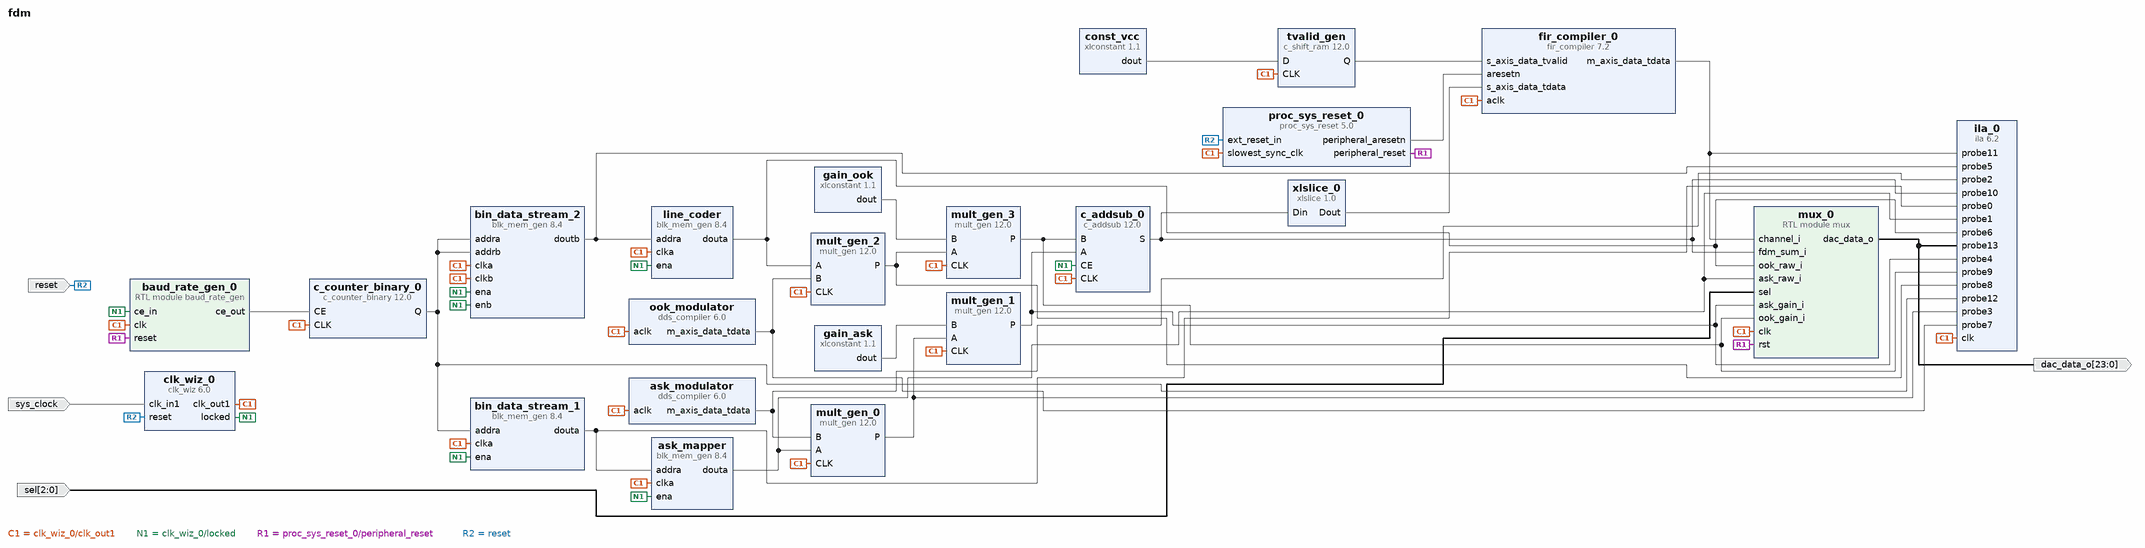
[diagram p0: block diagram of the top level]
# Vivado block design fdm, xc7z020clg400-1, Vivado 2025.2
create_bd_design fdm

create_bd_port -dir I -type clk sys_clock
set_property -dict {CONFIG.FREQ_HZ 125000000 CONFIG.PHASE 0.0} [get_bd_ports sys_clock]
create_bd_port -dir I -type rst reset
set_property -dict {CONFIG.POLARITY ACTIVE_HIGH} [get_bd_ports reset]
create_bd_port -dir I -from 2 -to 0 sel
create_bd_port -dir O -from 23 -to 0 dac_data_o

create_bd_cell -type ip -vlnv xilinx.com:ip:blk_mem_gen:8.4 bin_data_stream_1
set_property -dict [list \
  CONFIG.Coe_File ../../../../../../test.coe \
  CONFIG.Fill_Remaining_Memory_Locations true \
  CONFIG.Load_Init_File true \
  CONFIG.Memory_Type Single_Port_ROM \
  CONFIG.Write_Depth_A 16 \
  CONFIG.Write_Width_A 2 \
  CONFIG.use_bram_block Stand_Alone \
] [get_bd_cells bin_data_stream_1]
create_bd_cell -type ip -vlnv xilinx.com:ip:blk_mem_gen:8.4 ask_mapper
set_property -dict [list \
  CONFIG.Coe_File ../../../../../../mapper_4ask.coe \
  CONFIG.Enable_A Use_ENA_Pin \
  CONFIG.Fill_Remaining_Memory_Locations false \
  CONFIG.Load_Init_File true \
  CONFIG.Memory_Type Single_Port_ROM \
  CONFIG.Write_Depth_A 4 \
  CONFIG.Write_Width_A 16 \
  CONFIG.use_bram_block Stand_Alone \
] [get_bd_cells ask_mapper]
create_bd_cell -type ip -vlnv xilinx.com:ip:ila:6.2 ila_0
set_property -dict [list \
  CONFIG.ALL_PROBE_SAME_MU_CNT 4 \
  CONFIG.C_MONITOR_TYPE Native \
  CONFIG.C_NUM_OF_PROBES 14 \
  CONFIG.C_PROBE0_WIDTH 2 \
  CONFIG.C_PROBE10_WIDTH 40 \
  CONFIG.C_PROBE11_WIDTH 48 \
  CONFIG.C_PROBE12_WIDTH 4 \
  CONFIG.C_PROBE13_WIDTH 24 \
  CONFIG.C_PROBE1_WIDTH 16 \
  CONFIG.C_PROBE2_WIDTH 16 \
  CONFIG.C_PROBE3_WIDTH 32 \
  CONFIG.C_PROBE4_WIDTH 40 \
  CONFIG.C_PROBE5_WIDTH 1 \
  CONFIG.C_PROBE6_WIDTH 16 \
  CONFIG.C_PROBE7_WIDTH 16 \
  CONFIG.C_PROBE8_WIDTH 32 \
  CONFIG.C_PROBE9_WIDTH 40 \
] [get_bd_cells ila_0]
create_bd_cell -type ip -vlnv xilinx.com:ip:clk_wiz:6.0 clk_wiz_0
set_property -dict {CONFIG.CLK_IN1_BOARD_INTERFACE sys_clock CONFIG.USE_BOARD_FLOW true} [get_bd_cells clk_wiz_0]
create_bd_cell -type ip -vlnv xilinx.com:ip:dds_compiler:6.0 ask_modulator
set_property -dict {CONFIG.Output_Frequency1 1 CONFIG.PINC1 1010001111010111000010} [get_bd_cells ask_modulator]
create_bd_cell -type ip -vlnv xilinx.com:ip:mult_gen:12.0 mult_gen_0
set_property -dict {CONFIG.PortAWidth 16 CONFIG.PortBWidth 16} [get_bd_cells mult_gen_0]
create_bd_cell -type ip -vlnv xilinx.com:ip:mult_gen:12.0 mult_gen_1
set_property -dict {CONFIG.PortAWidth 32 CONFIG.PortBWidth 8} [get_bd_cells mult_gen_1]
create_bd_cell -type ip -vlnv xilinx.com:ip:xlconstant:1.1 gain_ask
set_property -dict {CONFIG.CONST_VAL 1 CONFIG.CONST_WIDTH 8} [get_bd_cells gain_ask]
create_bd_cell -type ip -vlnv xilinx.com:ip:blk_mem_gen:8.4 bin_data_stream_2
set_property -dict [list \
  CONFIG.Coe_File ../../../../../../data.coe \
  CONFIG.Fill_Remaining_Memory_Locations true \
  CONFIG.Load_Init_File true \
  CONFIG.Memory_Type Simple_Dual_Port_RAM \
  CONFIG.Read_Width_B 1 \
  CONFIG.Write_Depth_A 16 \
  CONFIG.Write_Width_A 1 \
  CONFIG.Write_Width_B 1 \
  CONFIG.use_bram_block Stand_Alone \
] [get_bd_cells bin_data_stream_2]
create_bd_cell -type ip -vlnv xilinx.com:ip:blk_mem_gen:8.4 line_coder
set_property -dict [list \
  CONFIG.Coe_File ../../../../../../mapper_2ask.coe \
  CONFIG.Enable_A Use_ENA_Pin \
  CONFIG.Fill_Remaining_Memory_Locations true \
  CONFIG.Load_Init_File true \
  CONFIG.Read_Width_A 16 \
  CONFIG.Use_Byte_Write_Enable false \
  CONFIG.Write_Depth_A 2 \
  CONFIG.Write_Width_A 16 \
  CONFIG.use_bram_block Stand_Alone \
] [get_bd_cells line_coder]
create_bd_cell -type ip -vlnv xilinx.com:ip:mult_gen:12.0 mult_gen_2
set_property -dict {CONFIG.PortAWidth 16 CONFIG.PortBWidth 16} [get_bd_cells mult_gen_2]
create_bd_cell -type ip -vlnv xilinx.com:ip:xlconstant:1.1 gain_ook
set_property -dict {CONFIG.CONST_VAL 1 CONFIG.CONST_WIDTH 8} [get_bd_cells gain_ook]
create_bd_cell -type ip -vlnv xilinx.com:ip:mult_gen:12.0 mult_gen_3
set_property -dict {CONFIG.PortAWidth 32 CONFIG.PortBWidth 8} [get_bd_cells mult_gen_3]
create_bd_cell -type ip -vlnv xilinx.com:ip:c_addsub:12.0 c_addsub_0
set_property -dict [list \
  CONFIG.A_Width 40 \
  CONFIG.B_Value 0000000000000000000000000000000000000000 \
  CONFIG.B_Width 40 \
  CONFIG.Latency 1 \
  CONFIG.Out_Width 40 \
] [get_bd_cells c_addsub_0]
create_bd_cell -type ip -vlnv xilinx.com:ip:fir_compiler:7.2 fir_compiler_0
set_property -dict [list \
  CONFIG.Clock_Frequency 125.0 \
  CONFIG.CoefficientVector {['-32767, -1750, -1769, -1778, -1763, -1733, -1679, -1615, -1519, -1412, -1275, -1125, -943, -748, -522, -281, -11, 272, 584, 909, 1260, 1620, 2008, 2401, 2822, 3242, 3702, 4150, 4636, 5117, 5645, 6114,', '6579, 7132, 7622, 8141, 8642, 9157, 9654, 10152, 10638, 11116, 11580, 12032, 12467, 12886, 13285, 13666, 14023, 14358, 14668, 14956, 15212, 15445, 15647, 15823, 15960, 16068, 16161, 16191, 16209,', '16191, 16161, 16068, 15960, 15823, 15647, 15445, 15212, 14956, 14668, 14358, 14023, 13666, 13285, 12886, 12467, 12032, 11580, 11116, 10638, 10152, 9654, 9157, 8642, 8141, 7622, 7132, 6579, 6114, 5645,', '5117, 4636, 4150, 3702, 3242, 2822, 2401, 2008, 1620, 1260, 909, 584, 272, -11, -281, -522, -748, -943, -1125, -1275, -1412, -1519, -1615, -1679, -1733, -1763, -1778, -1769, -1750, -32767']} \
  CONFIG.Coefficient_Fractional_Bits 0 \
  CONFIG.Coefficient_Sets 1 \
  CONFIG.Coefficient_Sign Signed \
  CONFIG.Coefficient_Structure Inferred \
  CONFIG.Coefficient_Width 16 \
  CONFIG.ColumnConfig 20,20,21 \
  CONFIG.Data_Width 24 \
  CONFIG.Has_ARESETn true \
  CONFIG.Output_Rounding_Mode Full_Precision \
  CONFIG.Output_Width 44 \
  CONFIG.Quantization Integer_Coefficients \
  CONFIG.Sample_Frequency 125.0 \
] [get_bd_cells fir_compiler_0]
create_bd_cell -type ip -vlnv xilinx.com:ip:c_shift_ram:12.0 tvalid_gen
set_property -dict {CONFIG.Depth 1 CONFIG.Width 1} [get_bd_cells tvalid_gen]
create_bd_cell -type ip -vlnv xilinx.com:ip:c_counter_binary:12.0 c_counter_binary_0
set_property -dict {CONFIG.CE true CONFIG.Output_Width 4} [get_bd_cells c_counter_binary_0]
create_bd_cell -type ip -vlnv xilinx.com:ip:proc_sys_reset:5.0 proc_sys_reset_0
create_bd_cell -type module -reference mux mux_0
create_bd_cell -type ip -vlnv xilinx.com:ip:xlconstant:1.1 const_vcc
set_property -dict {CONFIG.CONST_VAL 1} [get_bd_cells const_vcc]
create_bd_cell -type module -reference baud_rate_gen baud_rate_gen_0
create_bd_cell -type ip -vlnv xilinx.com:ip:dds_compiler:6.0 ook_modulator
set_property -dict {CONFIG.Output_Frequency1 2 CONFIG.PINC1 10100011110101110000101} [get_bd_cells ook_modulator]
create_bd_cell -type ip -vlnv xilinx.com:ip:xlslice:1.0 xlslice_0
set_property -dict {CONFIG.DIN_FROM 39 CONFIG.DIN_TO 16 CONFIG.DIN_WIDTH 40} [get_bd_cells xlslice_0]

# ---- connections ----

connect_bd_net [get_bd_pins ask_mapper/douta] [get_bd_pins ila_0/probe1] [get_bd_pins mux_0/ask_raw_i] [get_bd_pins mult_gen_0/A]
connect_bd_net [get_bd_pins ask_modulator/m_axis_data_tdata] [get_bd_pins mult_gen_0/B] [get_bd_pins ila_0/probe2]
connect_bd_net [get_bd_pins baud_rate_gen_0/ce_out] [get_bd_pins c_counter_binary_0/CE]
connect_bd_net [get_bd_pins bin_data_stream_1/douta] [get_bd_pins ask_mapper/addra] [get_bd_pins ila_0/probe0]
connect_bd_net [get_bd_pins bin_data_stream_2/doutb] [get_bd_pins line_coder/addra] [get_bd_pins ila_0/probe5]
connect_bd_net [get_bd_pins c_addsub_0/S] [get_bd_pins xlslice_0/Din] [get_bd_pins mux_0/fdm_sum_i] [get_bd_pins ila_0/probe10]
connect_bd_net [get_bd_pins c_counter_binary_0/Q] \
  [get_bd_pins bin_data_stream_1/addra] [get_bd_pins ila_0/probe12] [get_bd_pins bin_data_stream_2/addra] \
  [get_bd_pins bin_data_stream_2/addrb]
connect_bd_net [get_bd_pins clk_wiz_0/clk_out1] \
  [get_bd_pins bin_data_stream_1/clka] [get_bd_pins ask_mapper/clka] [get_bd_pins ila_0/clk] [get_bd_pins ask_modulator/aclk] \
  [get_bd_pins mult_gen_1/CLK] [get_bd_pins mult_gen_0/CLK] [get_bd_pins bin_data_stream_2/clka] \
  [get_bd_pins line_coder/clka] [get_bd_pins mult_gen_2/CLK] [get_bd_pins mult_gen_3/CLK] [get_bd_pins c_addsub_0/CLK] \
  [get_bd_pins fir_compiler_0/aclk] [get_bd_pins tvalid_gen/CLK] [get_bd_pins c_counter_binary_0/CLK] \
  [get_bd_pins bin_data_stream_2/clkb] [get_bd_pins proc_sys_reset_0/slowest_sync_clk] [get_bd_pins mux_0/clk] \
  [get_bd_pins baud_rate_gen_0/clk] [get_bd_pins ook_modulator/aclk]
connect_bd_net [get_bd_pins clk_wiz_0/locked] \
  [get_bd_pins bin_data_stream_1/ena] [get_bd_pins ask_mapper/ena] [get_bd_pins bin_data_stream_2/ena] \
  [get_bd_pins line_coder/ena] [get_bd_pins c_addsub_0/CE] [get_bd_pins bin_data_stream_2/enb] \
  [get_bd_pins baud_rate_gen_0/ce_in]
connect_bd_net [get_bd_pins const_vcc/dout] [get_bd_pins tvalid_gen/D]
connect_bd_net [get_bd_pins fir_compiler_0/m_axis_data_tdata] [get_bd_pins ila_0/probe11] [get_bd_pins mux_0/channel_i]
connect_bd_net [get_bd_pins gain_ask/dout] [get_bd_pins mult_gen_1/B]
connect_bd_net [get_bd_pins gain_ook/dout] [get_bd_pins mult_gen_3/B]
connect_bd_net [get_bd_pins line_coder/douta] [get_bd_pins ila_0/probe6] [get_bd_pins mux_0/ook_raw_i] [get_bd_pins mult_gen_2/A]
connect_bd_net [get_bd_pins mult_gen_0/P] [get_bd_pins mult_gen_1/A] [get_bd_pins ila_0/probe3]
connect_bd_net [get_bd_pins mult_gen_1/P] [get_bd_pins ila_0/probe4] [get_bd_pins c_addsub_0/A] [get_bd_pins mux_0/ask_gain_i]
connect_bd_net [get_bd_pins mult_gen_2/P] [get_bd_pins mult_gen_3/A] [get_bd_pins ila_0/probe8]
connect_bd_net [get_bd_pins mult_gen_3/P] [get_bd_pins ila_0/probe9] [get_bd_pins c_addsub_0/B] [get_bd_pins mux_0/ook_gain_i]
connect_bd_net [get_bd_pins mux_0/dac_data_o] [get_bd_pins ila_0/probe13] [get_bd_ports dac_data_o]
connect_bd_net [get_bd_pins ook_modulator/m_axis_data_tdata] [get_bd_pins mult_gen_2/B] [get_bd_pins ila_0/probe7]
connect_bd_net [get_bd_pins proc_sys_reset_0/peripheral_aresetn] [get_bd_pins fir_compiler_0/aresetn]
connect_bd_net [get_bd_pins proc_sys_reset_0/peripheral_reset] [get_bd_pins mux_0/rst] [get_bd_pins baud_rate_gen_0/reset]
connect_bd_net [get_bd_ports reset] [get_bd_pins clk_wiz_0/reset] [get_bd_pins proc_sys_reset_0/ext_reset_in]
connect_bd_net [get_bd_ports sel] [get_bd_pins mux_0/sel]
connect_bd_net [get_bd_ports sys_clock] [get_bd_pins clk_wiz_0/clk_in1]
connect_bd_net [get_bd_pins tvalid_gen/Q] [get_bd_pins fir_compiler_0/s_axis_data_tvalid]
connect_bd_net [get_bd_pins xlslice_0/Dout] [get_bd_pins fir_compiler_0/s_axis_data_tdata]

validate_bd_design
save_bd_design
